# Altium schematic sheet 3_P3_Charger.schdoc
size 307 x 218 mm; Symbol: Sheet-Symbol_A4; Device: Sheet-Symbol_A4; @Project Name: modular_design; @Page Count: 7; @Update Date: 2026-07-06; @Create Date: 2026-07-01; @Schematic Name: Schematic1; @Page No: 3; @Page Name: P3_Charger; @Board Name: Board1; Company: 嘉立创EDA; Version: V1.0; Page Size: A4; Convert to PCB: yes; Add into BOM: yes; Title Block Position: 3; Width: 1170; Height: 825; Region Start: 1; X Region Count: 6; Y Region Count: 4; Blade Width: 10; @Create Time: 08:23:38; @Update Time: 08:55:01
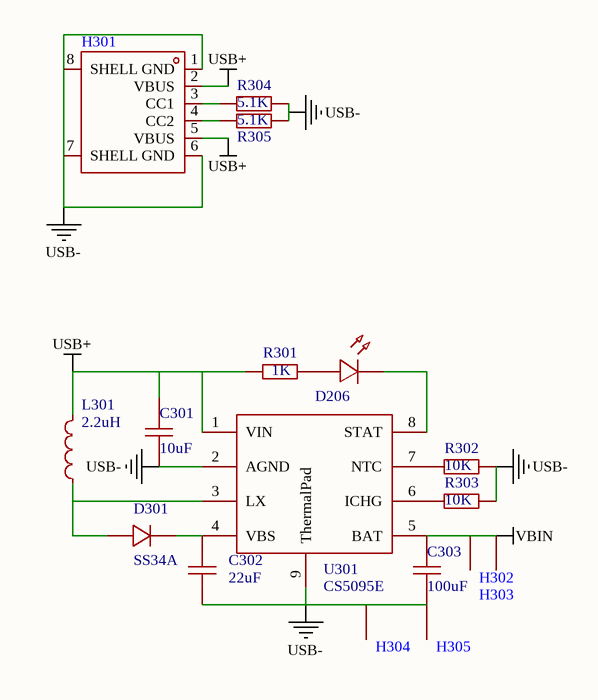
[diagram p0: 3_P3_Charger.schdoc]

## Parts
C301  10uF  [C0805]
C302  22uF  [C0805]
C303  100uF  [C0805]
D206  (no value)  [LED_0603]
D301  SS34A  [SMA_L4.3-W2.6-LS5.2-RD]
H301  (no value)  [typec-31-e-11]
H302  (no value)  [Single_Pin]
H303  (no value)  [Single_Pin]
H304  (no value)  [Single_Pin]
H305  (no value)  [Single_Pin]
L301  2.2uH  [IND-SMD_L5.8-W5.2]
R301  1K  [R0603]
R302  10K  [R0603]
R303  10K  [R0603]
R304  5.1K  [R0603]
R305  5.1K  [R0603]
U301  (no value)  [ESOP-8_L4.9-W3.9-P1.27-LS6.0-BL-EP]

## Nets
USB+: C301.1 H301.2(VBUS) H301.5(VBUS) L301.2 R301.2 U301.1(VIN)
USB-: C301.2 C302.2 C303.2 H301.1(GND) H301.6(GND) H301.7(SHELL) H301.8(SHELL) H304.1 H305.1 R302.1 R303.1 R304.1 R305.1 U301.2(AGND) U301.9(ThermalPad)
VBIN: C303.1 H302.1 H303.1 U301.5(BAT)
NetC302_1: C302.1 D301.1(C) U301.4(VBS)
NetD206_1: D206.1(C) U301.8(STAT)
NetD206_2: D206.2(A) R301.1
NetD301_2: D301.2(A) L301.1 U301.3(LX)
NetH301_3: H301.3(CC1) R304.2
NetH301_4: H301.4(CC2) R305.2
NetR302_2: R302.2 U301.7(NTC)
NetR303_2: R303.2 U301.6(ICHG)

## Notes on the sheet
- 1
- 2
- 3
- 4
- 5
- 6
- A
- B
- C
- 原理图
- Schematic1
- 创建日期
- 更新日期
- 2026-07-01
- 2026-07-06
- 绘制
- 板子
- Board1
- 图页
- P3_Charger
- D
- 审阅
- 版本
- 尺寸
- modular_design
- 页
- 共
- 7
- V1.0
- A4
- 嘉立创EDA

## Library data of the parts
C301-C303 = CAP_0603: Convert to PCB: yes; Symbol: CAP_0603; Device: CAP_0603; Add into BOM: yes; Supplier Footprint: 0603; Origin Footprint: C0805
  C301: Value: 10uF
  C302: Value: 22uF
  C303: Value: 100uF
D206 = LED_0603-R: Convert to PCB: yes; Symbol: LED_0603-R; Device: LED_0603-R; Add into BOM: yes; Supplier Footprint: 0603; Origin Footprint: LED_0603
D301 = SS34A_C211775: Manufacturer: YANGJIE(扬杰); Add into BOM: yes; Reverse Voltage (Vr): 40V; Average Rectified Current (Io): 3A; Forward Voltage (Vf@If): 500mV@3A; Symbol: SS34A_C211775; Device: SS34A_C211775; LCSC Part Name: 40V 3A 500mV@3A; Supplier Part: C211775; Manufacturer Part: SS34A; Supplier Footprint: SMA; JLCPCB Part Class: Extended Part; Datasheet: https://atta.szlcsc.com/upload/public/pdf/source/20190516/C211775_5CF5F6A2E43CD0CA4A389CCA8A88582C.pdf; Supplier: LCSC; Convert to PCB: yes; Origin Footprint: SMA_L4.3-W2.6-LS5.2-RD
H301 = typec-31-e-11: Add into BOM: yes; Symbol: typec-31-e-11; Device: typec-31-e-11; Convert to PCB: yes
H302-H305 = Single_Pin: Add into BOM: yes; Symbol: Single_Pin; Device: Single_Pin; Convert to PCB: yes
L301 = SCCD54-4R7MT: Manufacturer: Yanchuang(研创); Add into BOM: yes; Value: 4.7uH; Tolerance: ±20%; Rated Current: 2.5A; DC Resistance (DCR): 38mΩ; Symbol: SCCD54-4R7MT; Device: SCCD54-4R7MT; LCSC Part Name: 4.7uH ±20% 2.5A 38mΩ; Supplier Part: C532870; Manufacturer Part: SCCD54-4R7MT; Supplier Footprint: SMD; JLCPCB Part Class: Extended Part; Datasheet: https://atta.szlcsc.com/upload/public/pdf/source/20200515/C532850_02BFFFF91E0F9B1D12EE1A1A1220C654.pdf; Supplier: LCSC; Convert to PCB: yes; Origin Footprint: IND-SMD_L5.8-W5.2
R301-R303 = Res_0603: Convert to PCB: yes; Symbol: Res_0603; Device: Res_0603; Add into BOM: yes; Supplier Footprint: 0603; Origin Footprint: R0603
  R301: Value: 1K
  R302 R303: Value: 10K
R304 R305 = Res_0603: Convert to PCB: yes; Value: 10K; Symbol: Res_0603; Device: Res_0603; Add into BOM: yes; Supplier Footprint: 0603; Origin Footprint: R0603
U301 = CS5095E: Add into BOM: yes; Symbol: CS5095E; Device: CS5095E; Convert to PCB: yes; Origin Footprint: ESOP-8_L4.9-W3.9-P1.27-LS6.0-BL-EP